# Altium schematic sheet PSM_footprint.SchDoc
size A4; DrawnBy: Philip Rowse
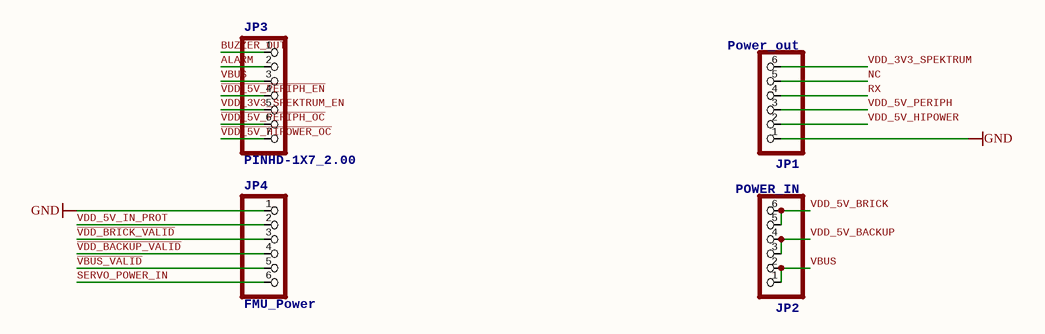
[diagram p0: PSM_footprint.SchDoc]

## Parts
JP1  Power_out  [1X06M]
JP2  POWER_IN  [1X06M]
JP3  PINHD-1X7_2.00  [1X07M]
JP4  FMU_Power  [1X06M]

## Nets
GND: JP1.1 JP4.1
ALARM: JP3.2
BUZZER_OUT: JP3.1
NC: JP1.5
RX: JP1.4
SERVO_POWER_IN: JP4.6
~{VBUS_VALID}: JP4.5
~{VDD_5V_HIPOWER_OC}: JP3.7
~{VDD_5V_PERIPH_EN}: JP3.4
~{VDD_5V_PERIPH_OC}: JP3.6
~{VDD_BACKUP_VALID}: JP4.4
~{VDD_BRICK_VALID}: JP4.3
VBUS: JP2.1 JP2.2 JP3.3
VDD_3V3_SPEKTRUM: JP1.6
VDD_3V3_SPEKTRUM_EN: JP3.5
VDD_5V_BACKUP: JP2.3 JP2.4
VDD_5V_BRICK: JP2.5 JP2.6
VDD_5V_HIPOWER: JP1.2
VDD_5V_IN_PROT: JP4.2
VDD_5V_PERIPH: JP1.3

## Notes on the sheet
- http://www.oshwa.org/
- http://creativecommons.org/licenses/by-sa/3.0/
- Title:
- Date:
- Time:
- Sheet:
- Approved:
- of:
- Drawn By:
- Checked By:
- ProfiCNC

## Library data of the parts
JP1 JP2 JP4 = PINHD-1X6_2.00